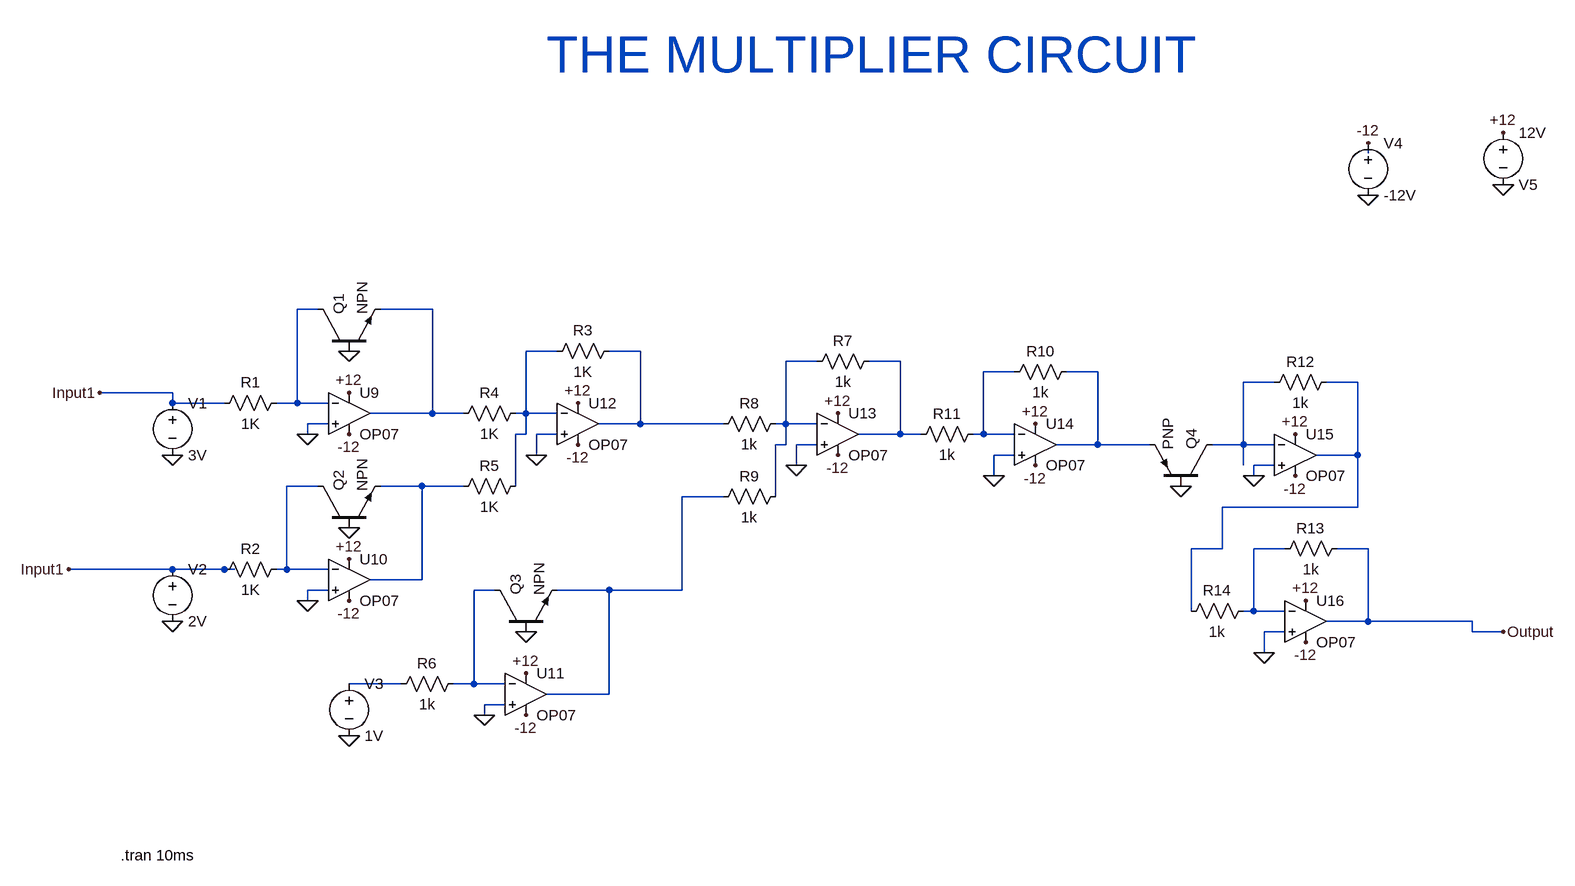
[diagram p0: schematic Multiplier.asc]
Multiplier.asc, the LTspice schematic file:
Version 4
SHEET 1 1964 824
WIRE 1648 -272 1648 -288
WIRE 32 -32 0 -32
WIRE 208 -32 128 -32
WIRE 400 32 352 32
WIRE 528 32 480 32
WIRE 800 48 752 48
WIRE 928 48 880 48
WIRE 1104 64 1056 64
WIRE 1232 64 1184 64
WIRE 1504 80 1456 80
WIRE 1632 80 1584 80
WIRE -192 96 -304 96
WIRE -192 112 -192 96
WIRE -112 112 -192 112
WIRE 0 112 0 -32
WIRE 0 112 -32 112
WIRE 48 112 0 112
WIRE 208 128 208 -32
WIRE 208 128 112 128
WIRE 256 128 208 128
WIRE 352 128 352 32
WIRE 352 128 336 128
WIRE 400 128 352 128
WIRE 48 144 16 144
WIRE 528 144 528 32
WIRE 528 144 464 144
WIRE 656 144 528 144
WIRE 752 144 752 48
WIRE 752 144 736 144
WIRE 800 144 752 144
WIRE 16 160 16 144
WIRE 352 160 352 128
WIRE 352 160 336 160
WIRE 400 160 368 160
WIRE 928 160 928 48
WIRE 928 160 864 160
WIRE 960 160 928 160
WIRE 1056 160 1056 64
WIRE 1056 160 1040 160
WIRE 1104 160 1056 160
WIRE 752 176 752 144
WIRE 752 176 736 176
WIRE 800 176 768 176
WIRE 1232 176 1232 64
WIRE 1232 176 1168 176
WIRE 1312 176 1232 176
WIRE 1456 176 1456 80
WIRE 1456 176 1408 176
WIRE 1504 176 1456 176
WIRE 368 192 368 160
WIRE 1104 192 1072 192
WIRE 1632 192 1632 80
WIRE 1632 192 1568 192
WIRE 768 208 768 176
WIRE 1456 208 1456 176
WIRE 1504 208 1472 208
WIRE 1072 224 1072 192
WIRE 1472 224 1472 208
WIRE 32 240 -16 240
WIRE 192 240 128 240
WIRE 256 240 192 240
WIRE 336 240 336 160
WIRE 656 256 592 256
WIRE 736 256 736 176
WIRE 1632 272 1632 192
WIRE 1632 272 1424 272
WIRE 1424 336 1424 272
WIRE 1424 336 1376 336
WIRE 1520 336 1472 336
WIRE 1648 336 1600 336
WIRE -192 368 -352 368
WIRE -112 368 -192 368
WIRE -96 368 -112 368
WIRE -16 368 -16 240
WIRE -16 368 -32 368
WIRE 48 368 -16 368
WIRE 192 384 192 240
WIRE 192 384 112 384
WIRE 48 400 16 400
WIRE 304 400 272 400
WIRE 480 400 400 400
WIRE 592 400 592 256
WIRE 592 400 480 400
WIRE 16 416 16 400
WIRE 1376 432 1376 336
WIRE 1472 432 1472 336
WIRE 1472 432 1456 432
WIRE 1520 432 1472 432
WIRE 1648 448 1648 336
WIRE 1648 448 1584 448
WIRE 1808 448 1648 448
WIRE 1520 464 1488 464
WIRE 1808 464 1808 448
WIRE 1856 464 1808 464
WIRE 1488 496 1488 464
WIRE 160 544 80 544
WIRE 272 544 272 400
WIRE 272 544 240 544
WIRE 320 544 272 544
WIRE 480 560 480 400
WIRE 480 560 384 560
WIRE 320 576 288 576
WIRE 288 592 288 576
FLAG 80 32 0
FLAG 80 304 0
FLAG 16 160 0
FLAG 16 416 0
FLAG -192 192 0
FLAG -192 448 0
FLAG 368 192 0
FLAG 352 464 0
FLAG 288 592 0
FLAG 80 624 0
FLAG 768 208 0
FLAG 1072 224 0
FLAG 1360 240 0
FLAG 1472 224 0
FLAG 1488 496 0
FLAG 1856 464 Output
FLAG -304 96 Input1
FLAG -352 368 Input1
FLAG 1648 -208 0
FLAG 1856 -224 0
FLAG 1856 -304 +12
FLAG 1536 160 +12
FLAG 1552 416 +12
FLAG 1136 144 +12
FLAG 832 128 +12
FLAG 432 112 +12
FLAG 80 96 +12
FLAG 80 352 +12
FLAG 352 528 +12
FLAG 1648 -288 -12
FLAG 80 160 -12
FLAG 432 176 -12
FLAG 80 416 -12
FLAG 352 592 -12
FLAG 832 192 -12
FLAG 1136 208 -12
FLAG 1536 224 -12
FLAG 1552 480 -12
SYMBOL voltage -192 96 R0
WINDOW 123 0 0 Left 2
WINDOW 39 0 0 Left 2
SYMATTR InstName V1
SYMATTR Value 3V
SYMBOL voltage -192 352 R0
WINDOW 123 0 0 Left 2
WINDOW 39 0 0 Left 2
SYMATTR InstName V2
SYMATTR Value 2V
SYMBOL res -16 96 R90
WINDOW 0 0 56 VBottom 2
WINDOW 3 32 56 VTop 2
SYMATTR InstName R1
SYMATTR Value 1K
SYMBOL res -16 352 R90
WINDOW 0 0 56 VBottom 2
WINDOW 3 32 56 VTop 2
SYMATTR InstName R2
SYMATTR Value 1K
SYMBOL res 496 16 R90
WINDOW 0 0 56 VBottom 2
WINDOW 3 32 56 VTop 2
SYMATTR InstName R3
SYMATTR Value 1K
SYMBOL res 352 112 R90
WINDOW 0 0 56 VBottom 2
WINDOW 3 32 56 VTop 2
SYMATTR InstName R4
SYMATTR Value 1K
SYMBOL res 352 224 R90
WINDOW 0 0 56 VBottom 2
WINDOW 3 32 56 VTop 2
SYMATTR InstName R5
SYMATTR Value 1K
SYMBOL voltage 80 528 R0
WINDOW 123 0 0 Left 2
WINDOW 39 0 0 Left 2
SYMATTR InstName V3
SYMATTR Value 1V
SYMBOL res 256 528 R90
WINDOW 0 0 56 VBottom 2
WINDOW 3 32 56 VTop 2
SYMATTR InstName R6
SYMATTR Value 1k
SYMBOL res 896 32 R90
WINDOW 0 0 56 VBottom 2
WINDOW 3 32 56 VTop 2
SYMATTR InstName R7
SYMATTR Value 1k
SYMBOL res 752 128 R90
WINDOW 0 0 56 VBottom 2
WINDOW 3 32 56 VTop 2
SYMATTR InstName R8
SYMATTR Value 1k
SYMBOL res 752 240 R90
WINDOW 0 0 56 VBottom 2
WINDOW 3 32 56 VTop 2
SYMATTR InstName R9
SYMATTR Value 1k
SYMBOL res 1200 48 R90
WINDOW 0 0 56 VBottom 2
WINDOW 3 32 56 VTop 2
SYMATTR InstName R10
SYMATTR Value 1k
SYMBOL res 1056 144 R90
WINDOW 0 0 56 VBottom 2
WINDOW 3 32 56 VTop 2
SYMATTR InstName R11
SYMATTR Value 1k
SYMBOL res 1600 64 R90
WINDOW 0 0 56 VBottom 2
WINDOW 3 32 56 VTop 2
SYMATTR InstName R12
SYMATTR Value 1k
SYMBOL res 1616 320 R90
WINDOW 0 0 56 VBottom 2
WINDOW 3 32 56 VTop 2
SYMATTR InstName R13
SYMATTR Value 1k
SYMBOL res 1472 416 R90
WINDOW 0 0 56 VBottom 2
WINDOW 3 32 56 VTop 2
SYMATTR InstName R14
SYMATTR Value 1k
SYMBOL npn 32 32 R270
SYMATTR InstName Q1
SYMBOL npn 32 304 R270
SYMATTR InstName Q2
SYMBOL npn 304 464 R270
SYMATTR InstName Q3
SYMBOL pnp 1408 240 M270
SYMATTR InstName Q4
SYMBOL Opamps\\OP07 80 64 R0
SYMATTR InstName U9
SYMBOL Opamps\\OP07 80 320 R0
SYMATTR InstName U10
SYMBOL Opamps\\OP07 352 496 R0
SYMATTR InstName U11
SYMBOL Opamps\\OP07 432 80 R0
SYMATTR InstName U12
SYMBOL Opamps\\OP07 832 96 R0
SYMATTR InstName U13
SYMBOL Opamps\\OP07 1136 112 R0
SYMATTR InstName U14
SYMBOL Opamps\\OP07 1552 384 R0
SYMATTR InstName U16
SYMBOL Opamps\\OP07 1536 128 R0
SYMATTR InstName U15
SYMBOL voltage 1648 -304 R0
WINDOW 123 0 0 Left 2
WINDOW 39 0 0 Left 2
SYMATTR InstName V4
SYMATTR Value -12V
SYMBOL voltage 1856 -320 R0
WINDOW 0 24 96 Left 2
WINDOW 3 24 16 Left 2
WINDOW 123 0 0 Left 2
WINDOW 39 0 0 Left 2
SYMATTR InstName V5
SYMATTR Value 12V
TEXT -272 808 Left 2 !.tran 10ms
TEXT 384 -424 Left 6 ;THE MULTIPLIER CIRCUIT

The netlist it stands for:
* Multiplier.asc
V1 Input1 0 3V
V2 Input1 0 2V
R1 N001 Input1 1K
R2 N011 Input1 1K
R3 N004 N003 1K
R4 N003 N002 1K
R5 N003 N012 1K
V3 N016 0 1V
R6 N015 N016 1k
R7 N006 N005 1k
R8 N005 N004 1k
R9 N005 N013 1k
R10 N008 N007 1k
R11 N007 N006 1k
R12 N010 N009 1k
R13 Output N014 1k
R14 N014 N010 1k
Q1 N001 0 N002 0 NPN
Q2 N011 0 N012 0 NPN
Q3 N015 0 N013 0 NPN
Q4 N009 0 N008 0 PNP
XU9 0 N001 +12 -12 N002 LT1001  ; OP07, pins In+ In- V+ V- OUT
XU10 0 N011 +12 -12 N012 LT1001  ; OP07, pins In+ In- V+ V- OUT
XU11 0 N015 +12 -12 N013 LT1001  ; OP07, pins In+ In- V+ V- OUT
XU12 0 N003 +12 -12 N004 LT1001  ; OP07, pins In+ In- V+ V- OUT
XU13 0 N005 +12 -12 N006 LT1001  ; OP07, pins In+ In- V+ V- OUT
XU14 0 N007 +12 -12 N008 LT1001  ; OP07, pins In+ In- V+ V- OUT
XU16 0 N014 +12 -12 Output LT1001  ; OP07, pins In+ In- V+ V- OUT
XU15 0 N009 +12 -12 N010 LT1001  ; OP07, pins In+ In- V+ V- OUT
V4 -12 0 -12V
V5 +12 0 12V
.model NPN NPN
.model PNP PNP
.lib standard.bjt
.tran 10ms
* THE MULTIPLIER CIRCUIT
.lib LTC.lib
.backanno
.end